# Altium project FourQuadrantDCMotorDrive.PrjPcb (part 2 of 3)
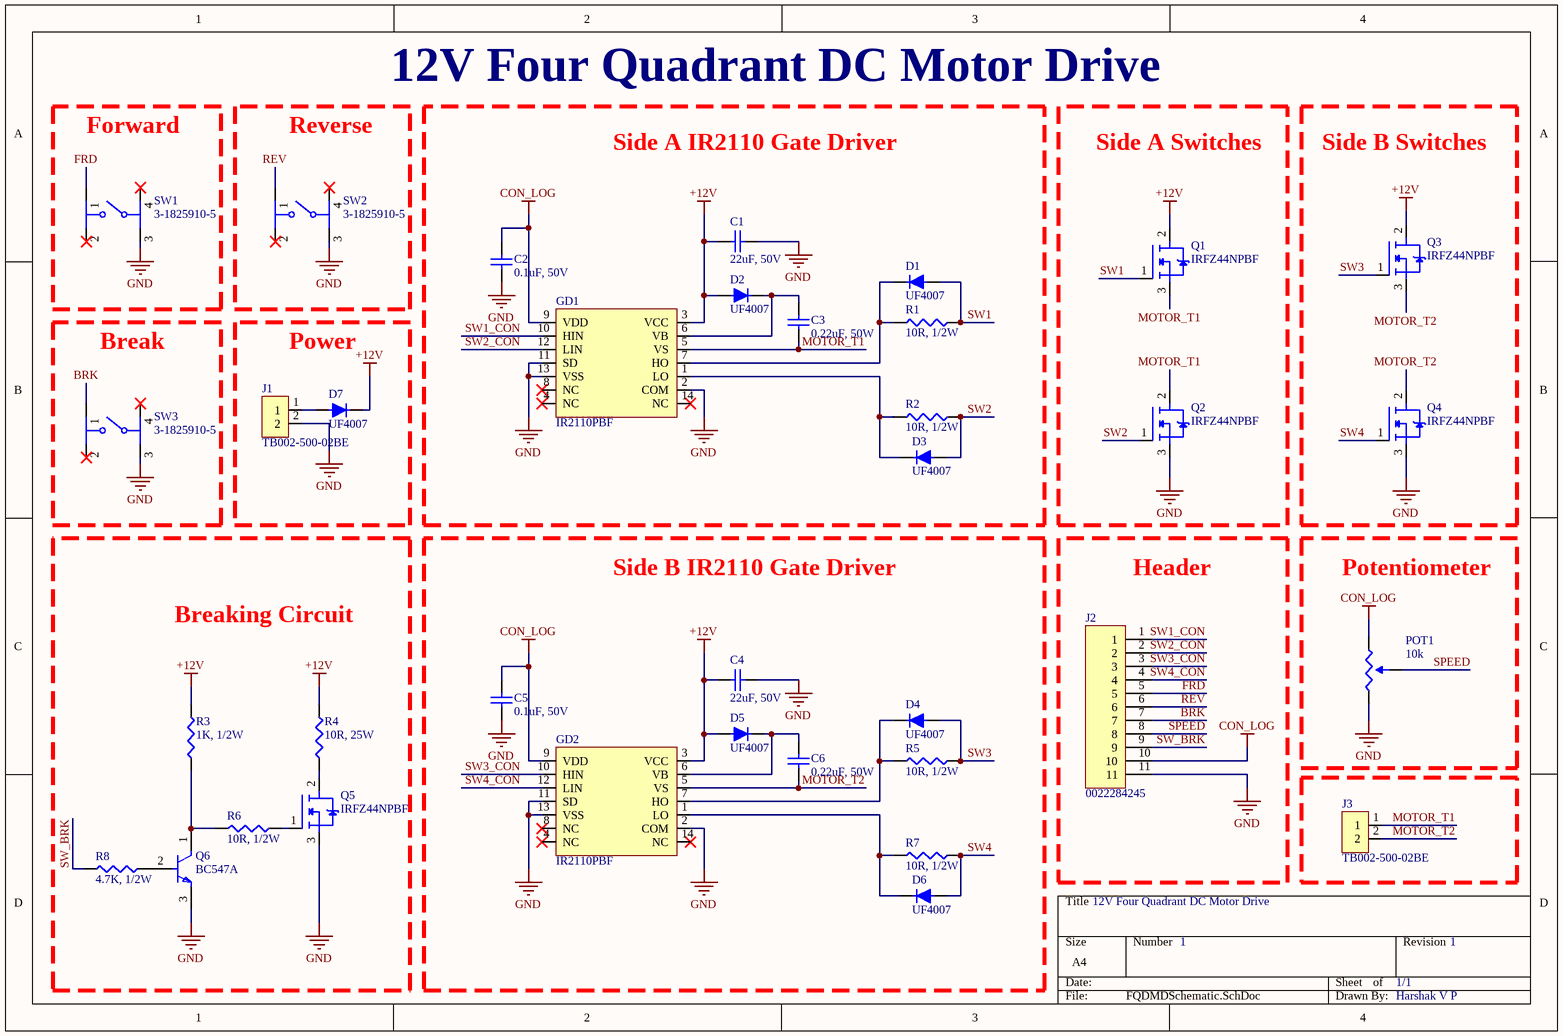
[diagram p1: FQDMDSchematic.SchDoc]

## Sheet FQDMDSchematic.SchDoc (continued)
### Library data of the parts
C1 C4 = SK226M050AC3AAKPLP: CAP ALUM 22UF 20% 50V RADIAL TH; Manufacturer: Yageo Group; Supplier: DigiKey; Supplier Part Number: 399-6108-ND; Manufacturer Part Number: SK226M050AC3AAKPLP; Category: Capacitors; Stock: 13633; Pricing: 1=0.17, 10=0.105, 50=0.0756, 100=0.0661, 500=0.04946, 1000=0.04419, 2500=0.03855, 5000=0.03511 (USD)
C2 C5 = C320C104K5R5TA: CAP CER 0.1UF 50V X7R RADIAL; Manufacturer: Yageo Group; Value: 100nF; Dielectric Material: Ceramic; Dissipation Factor: 2.5%; Dropout Voltage: 260mV; Lead/Base Style: Straight; Lead Diameter: 510µm; Lead Length: 7mm; Min Input Voltage: 8V; Output Current: 150mA; Output Voltage: 5V; Tolerance: 10%; Supplier: DigiKey; Supplier Part Number: 399-4264-ND; Manufacturer Part Number: C320C104K5R5TA; RoHS: Compliant; Category: Ceramic Capacitors; Stock: 174098; Pricing: 1=0.32, 10=0.186, 50=0.1356, 100=0.1202, 500=0.09408, 1000=0.08603, 2500=0.07755, 5000=0.07244 (USD); Case/Package: SOT-23-5; China RoHS: Compliant; Composition: Ceramic; Depth: 3.18mm; Dielectric: X7R; Export Control Classification Number (ECCN) Code: EAR99; Height: 5.84mm; Height - Seated (Max): 6.604mm; Harmonized Tariff Schedule (HTS) Code: 8532.24.00.60; Introduction Date: 2006-07-12; Lead Free: Lead Free; Lead Pitch: 2.54mm; Length: 5.08mm; Lifecycle Status: Production; Max Operating Temperature: 125°C; Min Operating Temperature: -55°C; Mounting Technology: Surface Mount; Pins: 2; Number of Terminals: 2; Packaging: Bulk; Radiation Hardening: No; REACH SVHC: Yes; Schedule B: 8532240060, 8532240060|8532240060, 8532240060|8532240060|8532240060, 8532240060|8532240060|8532240060|8532240060; Terminal Pitch: 2.54mm; Termination: Radial; Voltage: 50V; Voltage Rating: 50V; Voltage Rating (DC): 50V; Width: 3.18mm; ComponentLink1URL: https://datasheet.octopart.com:443/C320C104K5R5TA-KEMET-datasheet-182049030.pdf?src-supplier=IHS; ComponentLink1Description: https://datasheet.octopart.com:443/C320C104K5R5TA-KEMET-datasheet-182049030.pdf?src-supplier=IHS; ComponentLink2URL: https://datasheet.octopart.com:443/C320C104K5R5TA-KEMET-datasheet-101577198.pdf?src-supplier=Farnell; ComponentLink2Description: https://datasheet.octopart.com:443/C320C104K5R5TA-KEMET-datasheet-101577198.pdf?src-supplier=Farnell; ComponentLink3URL: https://datasheet.octopart.com:443/C320C104K5R5TA-KEMET-datasheet-82557385.pdf?src-supplier=Farnell; ComponentLink3Description: https://datasheet.octopart.com:443/C320C104K5R5TA-KEMET-datasheet-82557385.pdf?src-supplier=Farnell; ComponentLink4URL: https://datasheet.octopart.com:443/C320C104K5R5TA-Kemet-datasheet-120818.pdf?src-supplier=Farnell; ComponentLink4Description: https://datasheet.octopart.com:443/C320C104K5R5TA-Kemet-datasheet-120818.pdf?src-supplier=Farnell; ComponentLink5URL: https://datasheet.octopart.com:443/C320C104K5R5TA-KEMET-datasheet-181962010.pdf?src-supplier=Farnell; ComponentLink5Description: https://datasheet.octopart.com:443/C320C104K5R5TA-KEMET-datasheet-181962010.pdf?src-supplier=Farnell; ComponentLink6URL: https://datasheet.octopart.com:443/C320C104K5R5TA-KEMET-datasheet-74832429.pdf?src-supplier=Farnell; ComponentLink6Description: https://datasheet.octopart.com:443/C320C104K5R5TA-KEMET-datasheet-74832429.pdf?src-supplier=Farnell; ComponentLink7URL: https://datasheet.octopart.com:443/C320C104K5R5TA-Kemet-datasheet-66414062.pdf?src-supplier=element14+APAC; ComponentLink7Description: https://datasheet.octopart.com:443/C320C104K5R5TA-Kemet-datasheet-66414062.pdf?src-supplier=element14+APAC; ComponentLink8URL: https://datasheet.octopart.com:443/C320C104K5R5TA-Kemet-datasheet-17277851.pdf?src-supplier=Newark; ComponentLink8Description: https://datasheet.octopart.com:443/C320C104K5R5TA-Kemet-datasheet-17277851.pdf?src-supplier=Newark; ComponentLink9URL: https://datasheet.octopart.com:443/C320C104K5R5TA-KEMET-datasheet-176142619.pdf?src-supplier=Newark; ComponentLink9Description: https://datasheet.octopart.com:443/C320C104K5R5TA-KEMET-datasheet-176142619.pdf?src-supplier=Newark; ComponentLink10URL: https://datasheet.octopart.com:443/C320C104K5R5TA-Kemet-datasheet-7601896.pdf?src-supplier=Newark; ComponentLink10Description: https://datasheet.octopart.com:443/C320C104K5R5TA-Kemet-datasheet-7601896.pdf?src-supplier=Newark; ComponentLink11URL: https://datasheet.octopart.com:443/C320C104K5R5TA-KEMET-datasheet-134136068.pdf?src-supplier=Electro+Sonic; ComponentLink11Description: https://datasheet.octopart.com:443/C320C104K5R5TA-KEMET-datasheet-134136068.pdf?src-supplier=Electro+Sonic; ComponentLink12URL: https://datasheet.octopart.com:443/C320C104K5R5TA-KEMET-datasheet-140078780.pdf?src-supplier=TME; ComponentLink12Description: https://datasheet.octopart.com:443/C320C104K5R5TA-KEMET-datasheet-140078780.pdf?src-supplier=TME; ComponentLink13URL: https://datasheet.octopart.com:443/C320C104K5R5TA-KEMET-datasheet-68332006.pdf?src-supplier=TME; ComponentLink13Description: https://datasheet.octopart.com:443/C320C104K5R5TA-KEMET-datasheet-68332006.pdf?src-supplier=TME; ComponentLink14URL: https://datasheet.octopart.com:443/C320C104K5R5TA-Kemet-datasheet-62346230.pdf?src-supplier=TME; ComponentLink14Description: https://datasheet.octopart.com:443/C320C104K5R5TA-Kemet-datasheet-62346230.pdf?src-supplier=TME; ComponentLink15URL: https://datasheet.octopart.com:443/C320C104K5R5TA-Kemet-datasheet-17577310.pdf?src-supplier=TME; ComponentLink15Description: https://datasheet.octopart.com:443/C320C104K5R5TA-Kemet-datasheet-17577310.pdf?src-supplier=TME; ComponentLink16URL: https://datasheet.octopart.com:443/C320C104K5R5TA-KEMET-datasheet-151955016.pdf?src-supplier=SOS+electronic; ComponentLink16Description: https://datasheet.octopart.com:443/C320C104K5R5TA-KEMET-datasheet-151955016.pdf?src-supplier=SOS+electronic; ComponentLink17URL: https://datasheet.octopart.com:443/C320C104K5R5TA-Kemet-datasheet-48843691.pdf?src-supplier=RS+(Formerly+Allied+Electronics); ComponentLink17Description: https://datasheet.octopart.com:443/C320C104K5R5TA-Kemet-datasheet-48843691.pdf?src-supplier=RS+(Formerly+Allied+Electronics); ComponentLink18URL: https://datasheet.octopart.com:443/C320C104K5R5TA-Kemet-datasheet-10533010.pdf?src-supplier=Jameco; ComponentLink18Description: https://datasheet.octopart.com:443/C320C104K5R5TA-Kemet-datasheet-10533010.pdf?src-supplier=Jameco
C3 C6 = C322C224M5U5TA: CAP CER 0.22UF 50V Z5U RADIAL; Manufacturer: Yageo Group; Value: 220nF; Dielectric Material: Ceramic; Dissipation Factor: 4%; Lead/Base Style: Formed Leads; Lead Diameter: 510µm; Lead Length: 7mm; Tolerance: 20%; Supplier: DigiKey; Supplier Part Number: 399-4354-ND; Manufacturer Part Number: C322C224M5U5TA; RoHS: Compliant; Category: Ceramic Capacitors; Stock: 6246; Pricing: 1=0.46, 10=0.278, 50=0.2064, 100=0.1846, 500=0.14772, 1000=0.13634, 2500=0.12433, 5000=0.1171 (USD); Case/Package: Radial; China RoHS: Compliant; Depth: 3.18mm; Dielectric: Z5U; Export Control Classification Number (ECCN) Code: EAR99; Height: 6.6mm; Height - Seated (Max): 6.604mm; Harmonized Tariff Schedule (HTS) Code: 8532.24.00.60; Introduction Date: 2006-07-12; Lead Free: Lead Free; Lead Pitch: 5.08mm; Length: 5.08mm; Lifecycle Status: Production; Max Operating Temperature: 85°C; Min Operating Temperature: 10°C; Mounting Technology: PCB, Through Hole; Number of Terminals: 2; Packaging: Bulk; Radiation Hardening: No; REACH SVHC: Yes; Schedule B: 8532240060, 8532240060|8532240060|8532240060|8532240060|8532240060; Terminal Pitch: 5.08mm; Termination: Radial; Voltage: 50V; Voltage Rating: 50V; Voltage Rating (DC): 50V; Weight: 45.359237g; Width: 3.18mm; ComponentLink1URL: https://datasheet.octopart.com:443/C322C224M5U5TA-KEMET-datasheet-182049035.pdf?src-supplier=IHS; ComponentLink1Description: https://datasheet.octopart.com:443/C322C224M5U5TA-KEMET-datasheet-182049035.pdf?src-supplier=IHS; ComponentLink2URL: https://datasheet.octopart.com:443/C322C224M5U5TA-KEMET-datasheet-68331992.pdf?src-supplier=Farnell; ComponentLink2Description: https://datasheet.octopart.com:443/C322C224M5U5TA-KEMET-datasheet-68331992.pdf?src-supplier=Farnell; ComponentLink3URL: https://datasheet.octopart.com:443/C322C224M5U5TA-KEMET-datasheet-101577214.pdf?src-supplier=Farnell; ComponentLink3Description: https://datasheet.octopart.com:443/C322C224M5U5TA-KEMET-datasheet-101577214.pdf?src-supplier=Farnell; ComponentLink4URL: https://datasheet.octopart.com:443/C322C224M5U5TA-KEMET-datasheet-181962113.pdf?src-supplier=Farnell; ComponentLink4Description: https://datasheet.octopart.com:443/C322C224M5U5TA-KEMET-datasheet-181962113.pdf?src-supplier=Farnell; ComponentLink5URL: https://datasheet.octopart.com:443/C322C224M5U5TA-KEMET-datasheet-74832493.pdf?src-supplier=Farnell; ComponentLink5Description: https://datasheet.octopart.com:443/C322C224M5U5TA-KEMET-datasheet-74832493.pdf?src-supplier=Farnell; ComponentLink6URL: https://datasheet.octopart.com:443/C322C224M5U5TA-KEMET-datasheet-166950196.pdf?src-supplier=Newark; ComponentLink6Description: https://datasheet.octopart.com:443/C322C224M5U5TA-KEMET-datasheet-166950196.pdf?src-supplier=Newark; ComponentLink7URL: https://datasheet.octopart.com:443/C322C224M5U5TA-Kemet-datasheet-7601896.pdf?src-supplier=Newark; ComponentLink7Description: https://datasheet.octopart.com:443/C322C224M5U5TA-Kemet-datasheet-7601896.pdf?src-supplier=Newark; ComponentLink8URL: https://datasheet.octopart.com:443/C322C224M5U5TA-Kemet-datasheet-66414231.pdf?src-supplier=element14+APAC; ComponentLink8Description: https://datasheet.octopart.com:443/C322C224M5U5TA-Kemet-datasheet-66414231.pdf?src-supplier=element14+APAC; ComponentLink9URL: https://datasheet.octopart.com:443/C322C224M5U5TA-KEMET-datasheet-83995801.pdf?src-supplier=element14+APAC; ComponentLink9Description: https://datasheet.octopart.com:443/C322C224M5U5TA-KEMET-datasheet-83995801.pdf?src-supplier=element14+APAC; ComponentLink10URL: https://datasheet.octopart.com:443/C322C224M5U5TA-KEMET-datasheet-134136068.pdf?src-supplier=Electro+Sonic; ComponentLink10Description: https://datasheet.octopart.com:443/C322C224M5U5TA-KEMET-datasheet-134136068.pdf?src-supplier=Electro+Sonic; ComponentLink11URL: https://datasheet.octopart.com:443/C322C224M5U5TA-Kemet-datasheet-120818.pdf?src-supplier=RS+(Formerly+Allied+Electronics); ComponentLink11Description: https://datasheet.octopart.com:443/C322C224M5U5TA-Kemet-datasheet-120818.pdf?src-supplier=RS+(Formerly+Allied+Electronics); ComponentLink12URL: https://datasheet.octopart.com:443/C322C224M5U5TA-Kemet-datasheet-48843691.pdf?src-supplier=RS+(Formerly+Allied+Electronics); ComponentLink12Description: https://datasheet.octopart.com:443/C322C224M5U5TA-Kemet-datasheet-48843691.pdf?src-supplier=RS+(Formerly+Allied+Electronics); ComponentLink13URL: https://datasheet.octopart.com:443/C322C224M5U5TA-Kemet-datasheet-62346230.pdf?src-supplier=TME; ComponentLink13Description: https://datasheet.octopart.com:443/C322C224M5U5TA-Kemet-datasheet-62346230.pdf?src-supplier=TME; ComponentLink14URL: https://datasheet.octopart.com:443/C322C224M5U5TA-Kemet-datasheet-17577310.pdf?src-supplier=TME; ComponentLink14Description: https://datasheet.octopart.com:443/C322C224M5U5TA-Kemet-datasheet-17577310.pdf?src-supplier=TME
D1-D7 = UF4007: DIODE STANDARD 1000V 1A DO204AC; Manufacturer: Diotec; Manufacturer Lifecycle Status: ACTIVE; Element Configuration: Single; Forward Voltage: 1.7V; Max Forward Surge Current (Ifsm): 30A; Number of Elements: 1; Peak Non-Repetitive Surge Current: 33A; Peak Reverse Current: 5µA; Recovery Time: 75ns; Reverse Standoff Voltage: 1kV; Supplier: DigiKey; Supplier Part Number: 4878-UF4007TB-ND; Manufacturer Part Number: UF4007; RoHS: Compliant; Category: Rectifier Diodes; Stock: 19057; Pricing: 5000=0.05922, 10000=0.05352, 15000=0.0506, 25000=0.04733, 35000=0.04539, 50000=0.04351 (USD); Country of Origin: Mainland China; Export Control Classification Number (ECCN) Code: EAR99; Harmonized Tariff Schedule (HTS) Code: 85411000; Introduction Date: 2000-05-29; Lifecycle Status: Production; Max Operating Temperature: 150°C; Max Output current: 1A; Min Operating Temperature: -50°C; Mounting Technology: Axial; Pins: 2; Number of Terminals: 2; REACH SVHC: Unknown; Reverse Recovery Time: 75ns; Schedule B: 8541100080, 8541100080|8541100080, 8541100080|8541100080|8541100080, 8541100080|8541100080|8541100080|8541100080; Weight: 300mg; ComponentLink1URL: https://datasheet.octopart.com:443/UF4007-Diotec-datasheet-180727602.pdf?src-supplier=IHS; ComponentLink1Description: https://datasheet.octopart.com:443/UF4007-Diotec-datasheet-180727602.pdf?src-supplier=IHS; ComponentLink2URL: https://datasheet.octopart.com:443/UF4007-Diotec-datasheet-180579404.pdf?src-supplier=IHS; ComponentLink2Description: https://datasheet.octopart.com:443/UF4007-Diotec-datasheet-180579404.pdf?src-supplier=IHS; ComponentLink3URL: https://datasheet.octopart.com:443/UF4007-Diotec-datasheet-168810295.pdf?src-supplier=Diotec; ComponentLink3Description: https://datasheet.octopart.com:443/UF4007-Diotec-datasheet-168810295.pdf?src-supplier=Diotec; ComponentLink4URL: https://datasheet.octopart.com:443/UF4007-Diotec-datasheet-20772177.pdf?src-supplier=Component+Distributors+Inc.; ComponentLink4Description: https://datasheet.octopart.com:443/UF4007-Diotec-datasheet-20772177.pdf?src-supplier=Component+Distributors+Inc.; ComponentLink5URL: https://datasheet.octopart.com:443/UF4007-Diotec-datasheet-113245491.pdf?src-supplier=TME; ComponentLink5Description: https://datasheet.octopart.com:443/UF4007-Diotec-datasheet-113245491.pdf?src-supplier=TME; ComponentLink6URL: https://datasheet.octopart.com:443/UF4007-Diotec-datasheet-151952907.pdf?src-supplier=SOS+electronic; ComponentLink6Description: https://datasheet.octopart.com:443/UF4007-Diotec-datasheet-151952907.pdf?src-supplier=SOS+electronic; ComponentLink7URL: https://datasheet.octopart.com:443/UF4007-Diotec-datasheet-189099727.pdf?src-supplier=Master+Electronics; ComponentLink7Description: https://datasheet.octopart.com:443/UF4007-Diotec-datasheet-189099727.pdf?src-supplier=Master+Electronics
GD1 GD2 = IR2110PBF: IC GATE DRVR HALF-BRIDGE 14DIP; Manufacturer: Infineon; Channel Type: Independent; Fall Time: 25ns; Max Output current: 2.5A; Max Output Voltage: 20V; Max Power Dissipation: 1.6W; Max Supply Current: 340µA; Min Output Voltage: 10V; Min Supply Voltage: 3V; Nominal Supply Voltage (DC): 15V; Number of Channels: 2; Number of Circuits: 1; Propagation Delay: 150ns; Rise Time: 35ns; Turn-Off Delay Time: 10ns; Supplier: DigiKey; Supplier Part Number: IR2110PBF-ND; Manufacturer Part Number: IR2110PBF; RoHS: Compliant; Category: Gate Drivers; Stock: 3019; Pricing: 1=5.22, 10=3.949, 25=3.6308, 100=3.2815, 250=3.11496, 500=3.01456, 1000=2.9319, 2500=2.84466 (USD); Case/Package: DIP; Country of Origin: USA; Export Control Classification Number (ECCN) Code: EAR99; Height: 4.9276mm; Height - Seated (Max): 5.33mm; Harmonized Tariff Schedule (HTS) Code: 8542.39.00.01; Introduction Date: 1990-01-01; Lead Free: Contains Lead, Lead Free; Length: 19.305mm; Lifecycle Status: NRND; Max Operating Temperature: 125°C; Max Supply Voltage: 20V; Min Operating Temperature: -40°C; Mounting Technology: Through Hole; Number of Drivers: 2; Number of Outputs: 2; Pins: 14; Number of Terminals: 14; Operating Supply Current: 340µA; Operating Supply Voltage: 15V; Output Current: 2.5A; Output Voltage: 20V; Package Quantity: 1500; Power Dissipation: 1.6W; Radiation Hardening: No; REACH SVHC: Yes; Schedule B: 8542310000, 8542310000|8542310000|8542310000|8542310000|8542310000; Temperature Grade: Automotive; Terminal Pitch: 2.54mm; Termination: Through Hole; Turn-On Delay Time: 10ns; Type: Integrated Circuit (IC); Weight: 1.620005g; Width: 7.62mm; ComponentLink1URL: https://datasheet.octopart.com:443/IR2110PBF-Infineon-datasheet-141402711.pdf?src-supplier=IHS; ComponentLink1Description: https://datasheet.octopart.com:443/IR2110PBF-Infineon-datasheet-141402711.pdf?src-supplier=IHS; ComponentLink2URL: https://datasheet.octopart.com:443/IR2110PBF-International-Rectifier-datasheet-180119011.pdf?src-supplier=IHS; ComponentLink2Description: https://datasheet.octopart.com:443/IR2110PBF-International-Rectifier-datasheet-180119011.pdf?src-supplier=IHS; ComponentLink3URL: https://datasheet.octopart.com:443/IR2110PBF-Infineon-datasheet-3193.pdf?src-supplier=SHENGYU+ELECTRONICS; ComponentLink3Description: https://datasheet.octopart.com:443/IR2110PBF-Infineon-datasheet-3193.pdf?src-supplier=SHENGYU+ELECTRONICS; ComponentLink4URL: https://datasheet.octopart.com:443/IR2110PBF-International-Rectifier-datasheet-8380958.pdf?src-supplier=Jameco; ComponentLink4Description: https://datasheet.octopart.com:443/IR2110PBF-International-Rectifier-datasheet-8380958.pdf?src-supplier=Jameco; ComponentLink5URL: https://datasheet.octopart.com:443/IR2110-International-Rectifier-datasheet-82168.pdf?src-supplier=RS+(Formerly+Allied+Electronics); ComponentLink5Description: https://datasheet.octopart.com:443/IR2110-International-Rectifier-datasheet-82168.pdf?src-supplier=RS+(Formerly+Allied+Electronics); ComponentLink6URL: https://datasheet.octopart.com:443/IR2110PBF-International-Rectifier-datasheet-14156666.pdf?src-supplier=iiiC; ComponentLink6Description: https://datasheet.octopart.com:443/IR2110PBF-International-Rectifier-datasheet-14156666.pdf?src-supplier=iiiC; ComponentLink7URL: https://datasheet.octopart.com:443/IR2110PBF-International-Rectifier-datasheet-521366.pdf?src-supplier=Farnell; ComponentLink7Description: https://datasheet.octopart.com:443/IR2110PBF-International-Rectifier-datasheet-521366.pdf?src-supplier=Farnell; ComponentLink8URL: https://datasheet.octopart.com:443/IR2110-International-Rectifier-datasheet-101786.pdf?src-supplier=B%2bD+Enterprises; ComponentLink8Description: https://datasheet.octopart.com:443/IR2110-International-Rectifier-datasheet-101786.pdf?src-supplier=B%2bD+Enterprises; ComponentLink9URL: http://sigma.octopart.com:80/conflict_mineral_statement/Infineon-company-51.pdf?src-supplier=Compliance+Statements; ComponentLink9Description: http://sigma.octopart.com:80/conflict_mineral_statement/Infineon-company-51.pdf?src-supplier=Compliance+Statements; ComponentLink10URL: http://sigma.octopart.com:80/reach_statement/International-Rectifier-company-55.pdf?src-supplier=Compliance+Statements; ComponentLink10Description: http://sigma.octopart.com:80/reach_statement/International-Rectifier-company-55.pdf?src-supplier=Compliance+Statements; ComponentLink11URL: http://sigma.octopart.com:80/rohs_statement/International-Rectifier-company-54.pdf?src-supplier=Compliance+Statements; ComponentLink11Description: http://sigma.octopart.com:80/rohs_statement/International-Rectifier-company-54.pdf?src-supplier=Compliance+Statements
J1 J3 = TB002-500-02BE: TERMINAL BLOCK, SCREW TYPE, 5.00; Manufacturer: Same Sky; Approvals: CE, EN, IEC, UL, cUL; Current Rating: 15A; Number of Contacts: 2; Number of Levels: 1; Pitch: 5mm; Voltage Rating: 300V; Wire/Cable Gauge: 12AWG; Supplier: DigiKey; Supplier Part Number: 102-6145-ND; Manufacturer Part Number: TB002-500-02BE; RoHS: Compliant; Category: Terminal Blocks; Stock: 119506; Pricing: 1=0.32, 10=0.242, 25=0.212, 50=0.191, 100=0.1721, 250=0.15076, 500=0.13744, 3000=0.11318, 6000=0.10697 (USD); Color: Blue; Export Control Classification Number (ECCN) Code: EAR99; Height: 10mm; Harmonized Tariff Schedule (HTS) Code: 8536.90.40.00; Introduction Date: 2024-10-09; Lifecycle Status: Production; Max Operating Temperature: 105°C; Min Operating Temperature: -40°C; Mounting Technology: Screw; Pins: 2; Number of Rows: 1; Orientation: Horizontal; REACH SVHC: No; Width: 7.6mm; ComponentLink1URL: https://datasheet.octopart.com:443/TB002-500-02BE-Same-Sky-datasheet-181920249.pdf?src-supplier=Same+Sky; ComponentLink1Description: https://datasheet.octopart.com:443/TB002-500-02BE-Same-Sky-datasheet-181920249.pdf?src-supplier=Same+Sky; ComponentLink2URL: https://datasheet.octopart.com:443/TB002-500-02BE-CUI-Devices-datasheet-175928133.pdf?src-supplier=Same+Sky; ComponentLink2Description: https://datasheet.octopart.com:443/TB002-500-02BE-CUI-Devices-datasheet-175928133.pdf?src-supplier=Same+Sky; ComponentLink3URL: https://datasheet.octopart.com:443/TB002-500-02BE-CUI-Devices-datasheet-144794938.pdf?src-supplier=Same+Sky; ComponentLink3Description: https://datasheet.octopart.com:443/TB002-500-02BE-CUI-Devices-datasheet-144794938.pdf?src-supplier=Same+Sky; ComponentLink4URL: https://datasheet.octopart.com:443/TB002-500-02BE-CUI-Devices-datasheet-180438470.pdf?src-supplier=IHS; ComponentLink4Description: https://datasheet.octopart.com:443/TB002-500-02BE-CUI-Devices-datasheet-180438470.pdf?src-supplier=IHS; ComponentLink5URL: https://datasheet.octopart.com:443/TB002-500-02BE-Same-Sky-datasheet-190142077.pdf?src-supplier=element14+APAC; ComponentLink5Description: https://datasheet.octopart.com:443/TB002-500-02BE-Same-Sky-datasheet-190142077.pdf?src-supplier=element14+APAC; ComponentLink6URL: https://datasheet.octopart.com:443/TB002-500-02BE-Same-Sky-datasheet-182881440.pdf?src-supplier=Electro+Sonic; ComponentLink6Description: https://datasheet.octopart.com:443/TB002-500-02BE-Same-Sky-datasheet-182881440.pdf?src-supplier=Electro+Sonic; ComponentLink7URL: https://datasheet.octopart.com:443/TB002-500-02BE-CUI-Devices-datasheet-154730744.pdf?src-supplier=Electro+Sonic; ComponentLink7Description: https://datasheet.octopart.com:443/TB002-500-02BE-CUI-Devices-datasheet-154730744.pdf?src-supplier=Electro+Sonic; ComponentLink8URL: https://datasheet.octopart.com:443/TB002-500-02BE-Same-Sky-datasheet-189105710.pdf?src-supplier=Master+Electronics; ComponentLink8Description: https://datasheet.octopart.com:443/TB002-500-02BE-Same-Sky-datasheet-189105710.pdf?src-supplier=Master+Electronics; ComponentLink9URL: https://datasheet.octopart.com:443/TB002-500-02BE-Same-Sky-datasheet-182050243.pdf?src-supplier=Future+Electronics; ComponentLink9Description: https://datasheet.octopart.com:443/TB002-500-02BE-Same-Sky-datasheet-182050243.pdf?src-supplier=Future+Electronics; ComponentLink10URL: https://datasheet.octopart.com:443/TB002-500-02BE-CUI-Devices-datasheet-175928501.pdf?src-supplier=Future+Electronics; ComponentLink10Description: https://datasheet.octopart.com:443/TB002-500-02BE-CUI-Devices-datasheet-175928501.pdf?src-supplier=Future+Electronics; ComponentLink11URL: https://datasheet.octopart.com:443/TB002-500-02BE-CUI-Devices-datasheet-147843962.pdf?src-supplier=Future+Electronics; ComponentLink11Description: https://datasheet.octopart.com:443/TB002-500-02BE-CUI-Devices-datasheet-147843962.pdf?src-supplier=Future+Electronics; ComponentLink12URL: https://datasheet.octopart.com:443/TB002-500-02BE-CUI-Devices-datasheet-175927966.pdf?src-supplier=CUI+Devices+SCT; ComponentLink12Description: https://datasheet.octopart.com:443/TB002-500-02BE-CUI-Devices-datasheet-175927966.pdf?src-supplier=CUI+Devices+SCT; ComponentLink13URL: https://datasheet.octopart.com:443/TB002-500-02BE-CUI-Devices-datasheet-142371903.pdf?src-supplier=CUI+Devices+SCT; ComponentLink13Description: https://datasheet.octopart.com:443/TB002-500-02BE-CUI-Devices-datasheet-142371903.pdf?src-supplier=CUI+Devices+SCT; ComponentLink14URL: https://octopart.com:443/opatz8j6/c1?t=_d6XHqiISyMdz3GqDMpMVa-p_Jvkhvp5sNnCxcqWn_ULod65gYyeqtAU8mXIOh_Wg3w2RS8HUug8ukSetojDAYe4l9KdGQaHiEH-3uZoBX-ARHQ6m2-ifzFE8jWQyJanpY4-5hgJQ_3uAuJWX4Q_8gyYBLQP3-YByoJQkMZpVu2WGBRUizTI5j8332Nq1mENTS_ZWr51M3q1bd2u_-I4oRWUlnttELbb7Gqti6_mAy0BopwOYrCwQx9N8_qpRDW3jqACwInZ-biH7uwZUrr_ikmLrRkSJJSa1GtQqZAAkN6J57ershcppnqRGbLvO5pqO2zJ1RZ-7UEyE_sttVIoYe03865RlRVm6Ua41WuIkExvrQ&src-supplier=Compliance+Statements; ComponentLink14Description: https://octopart.com:443/opatz8j6/c1?t=_d6XHqiISyMdz3GqDMpMVa-p_Jvkhvp5sNnCxcqWn_ULod65gYyeqtAU8mXIOh_Wg3w2RS8HUug8ukSetojDAYe4l9KdGQaHiEH-3uZoBX-ARHQ6m2-ifzFE8jWQyJanpY4-5hgJQ_3uAuJWX4Q_8gyYBLQP3-YByoJQkMZpVu2WGBRUizTI5j8332Nq1mENTS_ZWr51M3q1bd2u_-I4oRWUlnttELbb7Gqti6_mAy0BopwOYrCwQx9N8_qpRDW3jqACwInZ-biH7uwZUrr_ikmLrRkSJJSa1GtQqZAAkN6J57ershcppnqRGbLvO5pqO2zJ1RZ-7UEyE_sttVIoYe03865RlRVm6Ua41WuIkExvrQ&src-supplier=Compliance+Statements; ComponentLink15URL: https://octopart.com:443/opatz8j6/c1?t=Fh69FySCC_FAAITLVE20KKXwtHtQqkTpoHLNA6Z5YWYFueRwD4q49mEj9O9PRSxBrakavMa31Pa8kd2r3fYUKygL4RoD-kVc1x4qeVz3Yb9Pj4FEkxlHbt_3t9jKY8NB2ui6d_hLRmCwNRAYRZ24_P0tmGdPsByxrvC2nzaecyFyrp6kn2T08PGgBVJgh6FXjbVyu4vRobeiGXpbDCwy7JXDj3RZnbTNNHDLzEi8aUUrQbLL6FvcrfvY9UcC4Z7NM0Mp6QYBnO31ttLBYTUSmmGYQD3BQuI437raKxIIRRpjklxenHLcr9SWZqtlQVlh5tRKpJeLIZOkwryk9ldPQbrjzf6tItEiepShso4m&src-supplier=Compliance+Statements; ComponentLink15Description: https://octopart.com:443/opatz8j6/c1?t=Fh69FySCC_FAAITLVE20KKXwtHtQqkTpoHLNA6Z5YWYFueRwD4q49mEj9O9PRSxBrakavMa31Pa8kd2r3fYUKygL4RoD-kVc1x4qeVz3Yb9Pj4FEkxlHbt_3t9jKY8NB2ui6d_hLRmCwNRAYRZ24_P0tmGdPsByxrvC2nzaecyFyrp6kn2T08PGgBVJgh6FXjbVyu4vRobeiGXpbDCwy7JXDj3RZnbTNNHDLzEi8aUUrQbLL6FvcrfvY9UcC4Z7NM0Mp6QYBnO31ttLBYTUSmmGYQD3BQuI437raKxIIRRpjklxenHLcr9SWZqtlQVlh5tRKpJeLIZOkwryk9ldPQbrjzf6tItEiepShso4m&src-supplier=Compliance+Statements; ComponentLink16URL: https://octopart.com:443/opatz8j6/c1?t=ZFxnMsm8sK3bD_kGUlZ1vBoLjtd3_wnTa5xCvrzWhqbv33Rbc1Vzl0KqEsDBOeYS-6nO5bqMiBMEbYeAxLQwKUbqTTlr9DGpqRpUh6_FciqCjj7lLOifF1By89luP7-VGXvA_aSs-Q8fic8YTZbO-yiWmglfOoz_DpnNKa0PZ7oxIKexP9wQrKgK6QKdf50TpcL_OfMCF0XFrhvmFs4hxPs1bqlQy7ktkiZKWcaQTV0U73jFrPMQ0U6W7adLUaPkfXicQfiwn6Iuk9lym1IjoLcKSr9Ir93zO2AylXmdyJhs9hAIgAOLhZsKLNWxFjSJqn4uB1VXAHsScVhsV3E83a4_oxNw2TrVibyCM28fsLWi4Q&src-supplier=Compliance+Statements; ComponentLink16Description: https://octopart.com:443/opatz8j6/c1?t=ZFxnMsm8sK3bD_kGUlZ1vBoLjtd3_wnTa5xCvrzWhqbv33Rbc1Vzl0KqEsDBOeYS-6nO5bqMiBMEbYeAxLQwKUbqTTlr9DGpqRpUh6_FciqCjj7lLOifF1By89luP7-VGXvA_aSs-Q8fic8YTZbO-yiWmglfOoz_DpnNKa0PZ7oxIKexP9wQrKgK6QKdf50TpcL_OfMCF0XFrhvmFs4hxPs1bqlQy7ktkiZKWcaQTV0U73jFrPMQ0U6W7adLUaPkfXicQfiwn6Iuk9lym1IjoLcKSr9Ir93zO2AylXmdyJhs9hAIgAOLhZsKLNWxFjSJqn4uB1VXAHsScVhsV3E83a4_oxNw2TrVibyCM28fsLWi4Q&src-supplier=Compliance+Statements; ComponentLink17URL: https://octopart.com:443/opatz8j6/c1?t=VHr7NaVe6D59iZsQQE60n8UI8GKnW7XBfT2cpY_5hBpGdOxnwbnsYcObjOlO5SPd7j1Y_eq0KLMA6vVg8wksPOR1baprHzaQWSi5QXTpvLsTIdCeJNcD4FG3FRVGioUqfNbDK_2u_JsLrVICQxHg6QdtXBp0Iznmn0fICWO7GQbQKq7q6HDTYUbFY5k-7KTF5O-lxIzS7RlH-GyKmf-3fgnfrjINXiTF4AUFp5D8bLPGWxHUzku-PH3wrMtUu9p9-7d3ZEfcNtR0jaQ7c11llhmLVTUcdwCd53QoqbVnvWJrfQdScf93rdF94vRPCZLKpB2mzy-IRH-Igm1TSdTqhMa1TrhLqLEnjLxhOp8K&src-supplier=Compliance+Statements; ComponentLink17Description: https://octopart.com:443/opatz8j6/c1?t=VHr7NaVe6D59iZsQQE60n8UI8GKnW7XBfT2cpY_5hBpGdOxnwbnsYcObjOlO5SPd7j1Y_eq0KLMA6vVg8wksPOR1baprHzaQWSi5QXTpvLsTIdCeJNcD4FG3FRVGioUqfNbDK_2u_JsLrVICQxHg6QdtXBp0Iznmn0fICWO7GQbQKq7q6HDTYUbFY5k-7KTF5O-lxIzS7RlH-GyKmf-3fgnfrjINXiTF4AUFp5D8bLPGWxHUzku-PH3wrMtUu9p9-7d3ZEfcNtR0jaQ7c11llhmLVTUcdwCd53QoqbVnvWJrfQdScf93rdF94vRPCZLKpB2mzy-IRH-Igm1TSdTqhMa1TrhLqLEnjLxhOp8K&src-supplier=Compliance+Statements
J2 = 0022284245: CONN HEADER VERT 24POS 2.54MM; Manufacturer: Molex; Manufacturer Lifecycle Status: ACTIVE; Contact Resistance: 20mΩ; Current Rating: 4A; Gender: Male; Insulation Resistance: 50GΩ; Number of Circuits: 24; Plating: Tin; Plating Thickness: 381nm; Ratings: CSA; Supplier: DigiKey; Supplier Part Number: 900-0022284245-ND; Manufacturer Part Number: 22-28-4245; RoHS: Compliant; Category: Headers and Wire Housings; Stock: 623; Pricing: 1=3.81, 10=3.237, 100=2.7512, 500=2.45582, 1000=2.33866 (USD); China RoHS: Compliant; Color: Black; Contact Material: Brass; Contact Plating: Gold; Country of Origin: US; Export Control Classification Number (ECCN) Code: EAR99; Housing Color: Black; Harmonized Tariff Schedule (HTS) Code: 8536.69.40.40; Introduction Date: 1994-12-01; Lead Free: Lead Free; Lifecycle Status: Production; Max Operating Temperature: 75°C; Min Operating Temperature: -40°C; Mounting Technology: Through Hole; Number of Contacts: 24; Pins: 24; Number of Positions: 24; Number of Rows: 1; Orientation: Vertical; Packaging: Bulk; Pitch: 2.54mm; REACH SVHC: Yes; Schedule B: 8536694040, 8536694040|8536694040|8536694040|8536694040|8536694040; Terminal Pitch: 2.54mm; Termination: Solder; ComponentLink1URL: https://datasheet.octopart.com:443/22-28-4245-Molex-datasheet-166051265.pdf?src-supplier=IHS; ComponentLink1Description: https://datasheet.octopart.com:443/22-28-4245-Molex-datasheet-166051265.pdf?src-supplier=IHS; ComponentLink2URL: https://datasheet.octopart.com:443/022284245-Molex-datasheet-8337137.pdf?src-supplier=Arrow+Electronics; ComponentLink2Description: https://datasheet.octopart.com:443/022284245-Molex-datasheet-8337137.pdf?src-supplier=Arrow+Electronics; ComponentLink3URL: https://datasheet.octopart.com:443/22-28-4245-Molex-datasheet-16300812.pdf?src-supplier=Molex; ComponentLink3Description: https://datasheet.octopart.com:443/22-28-4245-Molex-datasheet-16300812.pdf?src-supplier=Molex; ComponentLink4URL: https://sigma.octopart.com:443/16300370/technical_drawing/Molex-22-28-4245.pdf?src-supplier=Molex; ComponentLink4Description: https://sigma.octopart.com:443/16300370/technical_drawing/Molex-22-28-4245.pdf?src-supplier=Molex; ComponentLink5URL: https://datasheet.octopart.com:443/22-28-4245-Molex-datasheet-4210.pdf?src-supplier=DigiKey; ComponentLink5Description: https://datasheet.octopart.com:443/22-28-4245-Molex-datasheet-4210.pdf?src-supplier=DigiKey; ComponentLink6URL: http://sigma.octopart.com:80/16300813/rohs_statement/Molex-22-28-4245.pdf?src-supplier=Compliance+Statements; ComponentLink6Description: http://sigma.octopart.com:80/16300813/rohs_statement/Molex-22-28-4245.pdf?src-supplier=Compliance+Statements; ComponentLink7URL: http://sigma.octopart.com:80/reach_statement/Molex-company-74.pdf?src-supplier=Compliance+Statements; ComponentLink7Description: http://sigma.octopart.com:80/reach_statement/Molex-company-74.pdf?src-supplier=Compliance+Statements; ComponentLink8URL: http://sigma.octopart.com:80/rohs_statement/Molex-company-73.pdf?src-supplier=Compliance+Statements; ComponentLink8Description: http://sigma.octopart.com:80/rohs_statement/Molex-company-73.pdf?src-supplier=Compliance+Statements; ComponentLink9URL: http://sigma.octopart.com:80/conflict_mineral_statement/Molex-company-72.pdf?src-supplier=Compliance+Statements; ComponentLink9Description: http://sigma.octopart.com:80/conflict_mineral_statement/Molex-company-72.pdf?src-supplier=Compliance+Statements
POT1 = PTN24B-C1015DPA: POT 10K OHM 1/2W CARBON LOG; Manufacturer: Same Sky; Number of Turns: 1; Power Rating: 500mW; Value: 10kΩ; Tolerance: 20%; Working Voltage: 200V; Supplier: DigiKey; Supplier Part Number: 2223-PTN24B-C1015DPA-ND; Manufacturer Part Number: PTN24B-C1015DPA; Category: Variable Resistors and Potentiometers; Stock: 981; Pricing: 1=1.52, 10=1.27, 40=1.1365, 80=1.07475, 120=1.04, 280=0.97075, 520=0.9229, 1000=0.87477, 5000=0.76632 (USD); Composition: Carbon; Height: 30.5mm; Length: 24mm; Lifecycle Status: Production; Max Operating Temperature: 75°C; Min Operating Temperature: -10°C; Number of Terminals: 3; Width: 20.2mm; ComponentLink1URL: https://datasheet.octopart.com:443/PTN24B-C1015DPA-Same-Sky-datasheet-188841729.pdf?src-supplier=Same+Sky; ComponentLink1Description: https://datasheet.octopart.com:443/PTN24B-C1015DPA-Same-Sky-datasheet-188841729.pdf?src-supplier=Same+Sky; ComponentLink2URL: https://datasheet.octopart.com:443/PTN24B-C1015DPA-Same-Sky-datasheet-181918476.pdf?src-supplier=Same+Sky; ComponentLink2Description: https://datasheet.octopart.com:443/PTN24B-C1015DPA-Same-Sky-datasheet-181918476.pdf?src-supplier=Same+Sky; ComponentLink3URL: https://datasheet.octopart.com:443/PTN24B-C1015DPA-Same-Sky-datasheet-181918471.pdf?src-supplier=Same+Sky; ComponentLink3Description: https://datasheet.octopart.com:443/PTN24B-C1015DPA-Same-Sky-datasheet-181918471.pdf?src-supplier=Same+Sky; ComponentLink4URL: https://datasheet.octopart.com:443/PTN24B-C1015DPA-Same-Sky-datasheet-187906917.pdf?src-supplier=Master+Electronics; ComponentLink4Description: https://datasheet.octopart.com:443/PTN24B-C1015DPA-Same-Sky-datasheet-187906917.pdf?src-supplier=Master+Electronics; ComponentLink5URL: https://datasheet.octopart.com:443/PTN24B-C1015DPA-Same-Sky-datasheet-189105520.pdf?src-supplier=Master+Electronics; ComponentLink5Description: https://datasheet.octopart.com:443/PTN24B-C1015DPA-Same-Sky-datasheet-189105520.pdf?src-supplier=Master+Electronics; ComponentLink6URL: https://datasheet.octopart.com:443/PTN24B-C1015DPA-Same-Sky-datasheet-192883988.pdf?src-supplier=Farnell; ComponentLink6Description: https://datasheet.octopart.com:443/PTN24B-C1015DPA-Same-Sky-datasheet-192883988.pdf?src-supplier=Farnell; ComponentLink7URL: https://octopart.com:443/opatz8j6/c1?t=YQRvJ7gDvh_EQ6R75LgrlhbzJglIWd-Zs-_TbWp9zzyS7xMEun0TqdaotDUHxDpGHEwURK-qfBlwVEWsgmJ0dE_NkcOaHL_GalHLrllO6E0Q7Xd0_452wpsmYPPehPzYW7FYgN5IpniQC1llIPTmjl1R-X3y0ZwnLQdchG7SU2B74IZYJi5oMmDHXItJ8HB_66yRldMRj6y66xrmhr26xQMskvOoLNNikJogOuzL1tJULQfIXBCT1DzwDpjG562-6ncgU8LRDtMIOWUOES9GsFYQpzR-evdIEES4ZdYPzshuVnkkwEBwSdYe6QtQwjP6VBrh2au9hzVLXuEBhQ5corUWXPIk73f3o_0ns4L5rEXh&src-supplier=Compliance+Statements; ComponentLink7Description: https://octopart.com:443/opatz8j6/c1?t=YQRvJ7gDvh_EQ6R75LgrlhbzJglIWd-Zs-_TbWp9zzyS7xMEun0TqdaotDUHxDpGHEwURK-qfBlwVEWsgmJ0dE_NkcOaHL_GalHLrllO6E0Q7Xd0_452wpsmYPPehPzYW7FYgN5IpniQC1llIPTmjl1R-X3y0ZwnLQdchG7SU2B74IZYJi5oMmDHXItJ8HB_66yRldMRj6y66xrmhr26xQMskvOoLNNikJogOuzL1tJULQfIXBCT1DzwDpjG562-6ncgU8LRDtMIOWUOES9GsFYQpzR-evdIEES4ZdYPzshuVnkkwEBwSdYe6QtQwjP6VBrh2au9hzVLXuEBhQ5corUWXPIk73f3o_0ns4L5rEXh&src-supplier=Compliance+Statements; ComponentLink8URL: https://octopart.com:443/opatz8j6/c1?t=yd0XYqWMQOmLluRv1C33-lZKEhVePz7XjnhThX6xqc96f4wNtB5e1Jbbv_1ORIn0evzpUUOuwvSmkarLiepKyho86S4EXcajkEE52BANwgWr0sIq6zrlTKh73_f7uOZt13Mb82hWrjD7I3lD3Ftr80wI9hLT-eTEfiya_13K5Qre34dPnBCCDxNYjkzOwn6Kt4c5X8T-cXrdUkH7yrtsugvcjtzYxjkosQOIHkjPgsySin-0QnifZVVz4uC5OD642sJuQRzaDfPkMYIcQJd8or-eqt48xKsuAObUMiEGJVgs09SbKBMJX_o4qesJ3Q8--CuJe_Y8cmF3aL60XXS0fN005lPkr91m1SPBLahdUIDd&src-supplier=Compliance+Statements; ComponentLink8Description: https://octopart.com:443/opatz8j6/c1?t=yd0XYqWMQOmLluRv1C33-lZKEhVePz7XjnhThX6xqc96f4wNtB5e1Jbbv_1ORIn0evzpUUOuwvSmkarLiepKyho86S4EXcajkEE52BANwgWr0sIq6zrlTKh73_f7uOZt13Mb82hWrjD7I3lD3Ftr80wI9hLT-eTEfiya_13K5Qre34dPnBCCDxNYjkzOwn6Kt4c5X8T-cXrdUkH7yrtsugvcjtzYxjkosQOIHkjPgsySin-0QnifZVVz4uC5OD642sJuQRzaDfPkMYIcQJd8or-eqt48xKsuAObUMiEGJVgs09SbKBMJX_o4qesJ3Q8--CuJe_Y8cmF3aL60XXS0fN005lPkr91m1SPBLahdUIDd&src-supplier=Compliance+Statements
Q1-Q5 = IRFZ44NPBF: MOSFET N-CH 55V 49A TO220AB; Manufacturer: Infineon; Drain to Source Resistance: 17.5mΩ; Element Configuration: Single; Fall Time: 45ns; Gate to Source Voltage (Vgs): 20V; Input Capacitance: 1.47nF; Max Junction Temperature (Tj): 175°C; Max Power Dissipation: 94W; Nominal Vgs: 2.1V; Number of Elements: 1; Power Dissipation: 83W; Recovery Time: 95ns; Value: 17.5MΩ; Rise Time: 60ns; Turn-Off Delay Time: 44ns; Turn-On Delay Time: 12ns; Supplier: DigiKey; Supplier Part Number: IRFZ44NPBF-ND; Manufacturer Part Number: IRFZ44NPBF; RoHS: Compliant; Category: MOSFETs; Stock: 18868; Pricing: 1=1.81, 50=0.8528, 100=0.759, 500=0.59426, 1000=0.54123, 2000=0.49662, 5000=0.44834, 10000=0.41852 (USD); Case/Package: TO-220AB; Contact Plating: Tin; Continuous Drain Current (ID): 49A; Country of Origin: Mainland China, Mexico; Current Rating: 49A; Drain to Source Breakdown Voltage: 55V; Drain to Source Voltage (Vdss): 55V; Dual Supply Voltage: 55V; Export Control Classification Number (ECCN) Code: EAR99; Height: 8.77mm; Harmonized Tariff Schedule (HTS) Code: 8541.29.00.95; Introduction Date: 2003-10-31; Lead Free: Lead Free; Lead Pitch: 2.54mm; Length: 10.668mm; Lifecycle Status: Production; Max Operating Temperature: 175°C; Min Breakdown Voltage: 55V; Min Operating Temperature: -55°C; Mounting Technology: Through Hole; Pins: 3; Number of Terminals: 3; On-State Resistance: 17.5mΩ; Package Quantity: 1000; Packaging: Bulk; Radiation Hardening: No; Rds On Max: 17.5mΩ; REACH SVHC: Yes; Schedule B: 8541290080, 8541290080|8541290080, 8541290080|8541290080|8541290080, 8541290080|8541290080|8541290080|8541290080; Termination: Through Hole; Threshold Voltage: 2.1V; Voltage Rating (DC): 55V; Width: 4.826mm; ComponentLink1URL: https://datasheet.octopart.com:443/IRFZ44NPBF-Infineon-datasheet-10898344.pdf?src-supplier=IHS; ComponentLink1Description: https://datasheet.octopart.com:443/IRFZ44NPBF-Infineon-datasheet-10898344.pdf?src-supplier=IHS; ComponentLink2URL: https://datasheet.octopart.com:443/IRFZ44NPBF-Infineon-datasheet-180070255.pdf?src-supplier=IHS; ComponentLink2Description: https://datasheet.octopart.com:443/IRFZ44NPBF-Infineon-datasheet-180070255.pdf?src-supplier=IHS; ComponentLink3URL: https://datasheet.octopart.com:443/IRFZ44NPBF-Infineon-datasheet-163297.pdf?src-supplier=Farnell; ComponentLink3Description: https://datasheet.octopart.com:443/IRFZ44NPBF-Infineon-datasheet-163297.pdf?src-supplier=Farnell; ComponentLink4URL: https://datasheet.octopart.com/IRFZ44NPBF-Infineon-datasheet-7575919.pdf; ComponentLink4Description: https://datasheet.octopart.com/IRFZ44NPBF-Infineon-datasheet-7575919.pdf; ComponentLink5URL: https://datasheet.octopart.com:443/IRFZ44N-International-Rectifier-datasheet-82086.pdf?src-supplier=Newark; ComponentLink5Description: https://datasheet.octopart.com:443/IRFZ44N-International-Rectifier-datasheet-82086.pdf?src-supplier=Newark; ComponentLink6URL: https://datasheet.octopart.com:443/IRFZ44NPBF-International-Rectifier-datasheet-7564879.pdf?src-supplier=_legacy+Avnet; ComponentLink6Description: https://datasheet.octopart.com:443/IRFZ44NPBF-International-Rectifier-datasheet-7564879.pdf?src-supplier=_legacy+Avnet; ComponentLink7URL: https://datasheet.octopart.com:443/IRFZ44NPBF-International-Rectifier-datasheet-14061588.pdf?src-supplier=iiiC; ComponentLink7Description: https://datasheet.octopart.com:443/IRFZ44NPBF-International-Rectifier-datasheet-14061588.pdf?src-supplier=iiiC; ComponentLink8URL: https://datasheet.octopart.com:443/IRFZ44N-International-Rectifier-datasheet-10733621.pdf?src-supplier=iiiC; ComponentLink8Description: https://datasheet.octopart.com:443/IRFZ44N-International-Rectifier-datasheet-10733621.pdf?src-supplier=iiiC; ComponentLink9URL: https://datasheet.octopart.com:443/IRFZ44NPBF-Infineon-datasheet-9874387.pdf?src-supplier=RS+(Formerly+Allied+Electronics); ComponentLink9Description: https://datasheet.octopart.com:443/IRFZ44NPBF-Infineon-datasheet-9874387.pdf?src-supplier=RS+(Formerly+Allied+Electronics); ComponentLink10URL: https://datasheet.octopart.com:443/IRFZ44N-International-Rectifier-datasheet-58767.pdf?src-supplier=RS+(Formerly+Allied+Electronics); ComponentLink10Description: https://datasheet.octopart.com:443/IRFZ44N-International-Rectifier-datasheet-58767.pdf?src-supplier=RS+(Formerly+Allied+Electronics); ComponentLink11URL: https://datasheet.octopart.com:443/IRFZ44NPBF-Infineon-datasheet-7280676.pdf?src-supplier=Jameco; ComponentLink11Description: https://datasheet.octopart.com:443/IRFZ44NPBF-Infineon-datasheet-7280676.pdf?src-supplier=Jameco; ComponentLink12URL: https://datasheet.octopart.com:443/IRFZ44NPBF-International-Rectifier-datasheet-92204.pdf?src-supplier=DigiKey; ComponentLink12Description: https://datasheet.octopart.com:443/IRFZ44NPBF-International-Rectifier-datasheet-92204.pdf?src-supplier=DigiKey; ComponentLink13URL: http://sigma.octopart.com:80/conflict_mineral_statement/Infineon-company-51.pdf?src-supplier=Compliance+Statements; ComponentLink13Description: http://sigma.octopart.com:80/conflict_mineral_statement/Infineon-company-51.pdf?src-supplier=Compliance+Statements; ComponentLink14URL: http://sigma.octopart.com:80/reach_statement/International-Rectifier-company-55.pdf?src-supplier=Compliance+Statements; ComponentLink14Description: http://sigma.octopart.com:80/reach_statement/International-Rectifier-company-55.pdf?src-supplier=Compliance+Statements; ComponentLink15URL: http://sigma.octopart.com:80/rohs_statement/International-Rectifier-company-54.pdf?src-supplier=Compliance+Statements; ComponentLink15Description: http://sigma.octopart.com:80/rohs_statement/International-Rectifier-company-54.pdf?src-supplier=Compliance+Statements
Q6 = BC547A: TRANS NPN 45V 0.1A TO-92; Manufacturer: Diotec; Manufacturer Lifecycle Status: ACTIVE; Collector Emitter Saturation Voltage: 600mV; hFE Min: 110; Max Collector Current: 100mA; Max Power Dissipation: 500mW; Number of Channels: 1; Transition Frequency: 300MHz; Supplier: DigiKey; Supplier Part Number: 4878-BC547ATB-ND; Manufacturer Part Number: BC547A; RoHS: Compliant; Category: BJTs; Stock: 3793; Pricing: 4000=0.0267, 8000=0.02375, 12000=0.02224, 20000=0.02054, 28000=0.01954, 40000=0.01856 (USD); Case/Package: TO-92; Collector Emitter Voltage (VCEO): 45V; Country of Origin: Mainland China; Export Control Classification Number (ECCN) Code: EAR99; Harmonized Tariff Schedule (HTS) Code: 85412100; Introduction Date: 2002-03-22; Lifecycle Status: Production; Max Operating Temperature: 150°C; Mounting Technology: Through Hole; Number of Elements: 1; Number of Terminals: 3; Polarity: NPN; Power Dissipation: 500mW; REACH SVHC: Unknown; Weight: 336mg; ComponentLink1URL: https://datasheet.octopart.com:443/BC547A-Diotec-datasheet-166821072.pdf?src-supplier=IHS; ComponentLink1Description: https://datasheet.octopart.com:443/BC547A-Diotec-datasheet-166821072.pdf?src-supplier=IHS; ComponentLink2URL: https://datasheet.octopart.com:443/BC547A-Diotec-datasheet-17564947.pdf?src-supplier=Component+Distributors+Inc.; ComponentLink2Description: https://datasheet.octopart.com:443/BC547A-Diotec-datasheet-17564947.pdf?src-supplier=Component+Distributors+Inc.; ComponentLink3URL: https://datasheet.octopart.com:443/BC547A-Diotec-datasheet-113241320.pdf?src-supplier=TME; ComponentLink3Description: https://datasheet.octopart.com:443/BC547A-Diotec-datasheet-113241320.pdf?src-supplier=TME; ComponentLink4URL: https://datasheet.octopart.com:443/BC547A-Diotec-datasheet-188865637.pdf?src-supplier=TME; ComponentLink4Description: https://datasheet.octopart.com:443/BC547A-Diotec-datasheet-188865637.pdf?src-supplier=TME
R1 R2 R5-R7 = CFR-50JB-52-10R: RES 10 OHM 5% 1/2W AXIAL; Manufacturer: Yageo Group; Lead Diameter: 550µm; Lead Length: 26mm; Max Power Dissipation: 500mW; Value: 10Ω; Temperature Coefficient: 500ppm/°C; Working Voltage: 350V; Supplier: DigiKey; Supplier Part Number: 13-CFR-50JB-52-10R-ND; Manufacturer Part Number: CFR-50JB-52-10R; RoHS: Compliant; Category: Through-Hole Resistors; Stock: 18511; Pricing: 1=0.1, 10=0.05, 25=0.0416, 50=0.0364, 100=0.032, 250=0.0272, 500=0.02418, 1000=0.02161, 5000=0.01702 (USD); Case/Package: Axial; China RoHS: Compliant; Composition: Carbon Film; Diameter: 3.3mm; Length: 9mm; Lifecycle Status: Production; Max Operating Temperature: 155°C; Min Operating Temperature: -55°C; Number of Terminals: 2; Number of Terminations: 2; Packaging: Bulk; Power Rating: 500mW; Ratings: AEC-Q200; REACH SVHC: Yes; Tolerance: 5%; ComponentLink1URL: https://datasheet.octopart.com:443/CFR-50JB-52-10R-Yageo-datasheet-175860721.pdf?src-supplier=Farnell; ComponentLink1Description: https://datasheet.octopart.com:443/CFR-50JB-52-10R-Yageo-datasheet-175860721.pdf?src-supplier=Farnell; ComponentLink2URL: https://datasheet.octopart.com:443/CFR-50JB-52-10R-Yageo-Group-datasheet-184398216.pdf?src-supplier=Future+Electronics; ComponentLink2Description: https://datasheet.octopart.com:443/CFR-50JB-52-10R-Yageo-Group-datasheet-184398216.pdf?src-supplier=Future+Electronics; ComponentLink3URL: https://datasheet.octopart.com:443/CFR-50JB-52-10R-Yageo-datasheet-165493773.pdf?src-supplier=Future+Electronics; ComponentLink3Description: https://datasheet.octopart.com:443/CFR-50JB-52-10R-Yageo-datasheet-165493773.pdf?src-supplier=Future+Electronics; ComponentLink4URL: https://datasheet.octopart.com:443/CFR-50JB-52-10R-Yageo-datasheet-155367611.pdf?src-supplier=Future+Electronics; ComponentLink4Description: https://datasheet.octopart.com:443/CFR-50JB-52-10R-Yageo-datasheet-155367611.pdf?src-supplier=Future+Electronics; ComponentLink5URL: https://datasheet.octopart.com:443/CFR-50JB-52-10R-Yageo-datasheet-137875058.pdf?src-supplier=Future+Electronics; ComponentLink5Description: https://datasheet.octopart.com:443/CFR-50JB-52-10R-Yageo-datasheet-137875058.pdf?src-supplier=Future+Electronics; ComponentLink6URL: http://sigma.octopart.com:80/conflict_mineral_statement/Yageo-company-3.pdf?src-supplier=Compliance+Statements; ComponentLink6Description: http://sigma.octopart.com:80/conflict_mineral_statement/Yageo-company-3.pdf?src-supplier=Compliance+Statements; ComponentLink7URL: http://sigma.octopart.com:80/rohs_statement/Yageo-company-2.pdf?src-supplier=Compliance+Statements; ComponentLink7Description: http://sigma.octopart.com:80/rohs_statement/Yageo-company-2.pdf?src-supplier=Compliance+Statements
R3 = CFR50SJT-52-1K: RES 1K OHM 5% 1/2W AXIAL; Manufacturer: Yageo Group; Lead Diameter: 550µm; Power Rating: 500mW; Value: 1kΩ; Working Voltage: 300V; Supplier: DigiKey; Supplier Part Number: 13-CFR50SJT-52-1KCT-ND; Manufacturer Part Number: CFR50SJT-52-1K; RoHS: Compliant; Category: Through-Hole Resistors; Stock: 8784; Pricing: 1=0.1, 10=0.048, 25=0.0404, 50=0.0352, 100=0.031, 250=0.02632, 500=0.02338, 1000=0.02089 (USD); China RoHS: Compliant; Composition: Carbon Film; Country of Origin: Mainland China, Taiwan; Diameter: 2.4mm; Export Control Classification Number (ECCN) Code: EAR99; Harmonized Tariff Schedule (HTS) Code: 8533.10.00.65; Introduction Date: 2007-10-26; Length: 6.3mm; Lifecycle Status: Production; Max Operating Temperature: 155°C; Min Operating Temperature: -55°C; Number of Terminals: 2; Ratings: AEC-Q200; REACH SVHC: Yes; Tolerance: 5%; ComponentLink1URL: https://datasheet.octopart.com:443/CFR50SJT-52-1K-Yageo-datasheet-175860721.pdf?src-supplier=IHS; ComponentLink1Description: https://datasheet.octopart.com:443/CFR50SJT-52-1K-Yageo-datasheet-175860721.pdf?src-supplier=IHS; ComponentLink2URL: https://datasheet.octopart.com:443/CFR50SJT-52-1K-Yageo-datasheet-155367611.pdf?src-supplier=Farnell; ComponentLink2Description: https://datasheet.octopart.com:443/CFR50SJT-52-1K-Yageo-datasheet-155367611.pdf?src-supplier=Farnell; ComponentLink3URL: https://datasheet.octopart.com:443/CFR50SJT-52-1K-Yageo-Group-datasheet-184398216.pdf?src-supplier=Future+Electronics; ComponentLink3Description: https://datasheet.octopart.com:443/CFR50SJT-52-1K-Yageo-Group-datasheet-184398216.pdf?src-supplier=Future+Electronics; ComponentLink4URL: https://datasheet.octopart.com:443/CFR50SJT-52-1K-Yageo-datasheet-137875058.pdf?src-supplier=Future+Electronics; ComponentLink4Description: https://datasheet.octopart.com:443/CFR50SJT-52-1K-Yageo-datasheet-137875058.pdf?src-supplier=Future+Electronics; ComponentLink5URL: https://datasheet.octopart.com:443/CFR50SJT-52-1K-Yageo-datasheet-28066625.pdf?src-supplier=Future+Electronics; ComponentLink5Description: https://datasheet.octopart.com:443/CFR50SJT-52-1K-Yageo-datasheet-28066625.pdf?src-supplier=Future+Electronics; ComponentLink6URL: http://sigma.octopart.com:80/conflict_mineral_statement/Yageo-company-3.pdf?src-supplier=Compliance+Statements; ComponentLink6Description: http://sigma.octopart.com:80/conflict_mineral_statement/Yageo-company-3.pdf?src-supplier=Compliance+Statements; ComponentLink7URL: http://sigma.octopart.com:80/rohs_statement/Yageo-company-2.pdf?src-supplier=Compliance+Statements; ComponentLink7Description: http://sigma.octopart.com:80/rohs_statement/Yageo-company-2.pdf?src-supplier=Compliance+Statements